# EAGLE design BaseBoard_1 (EAGLE 9.6.2)
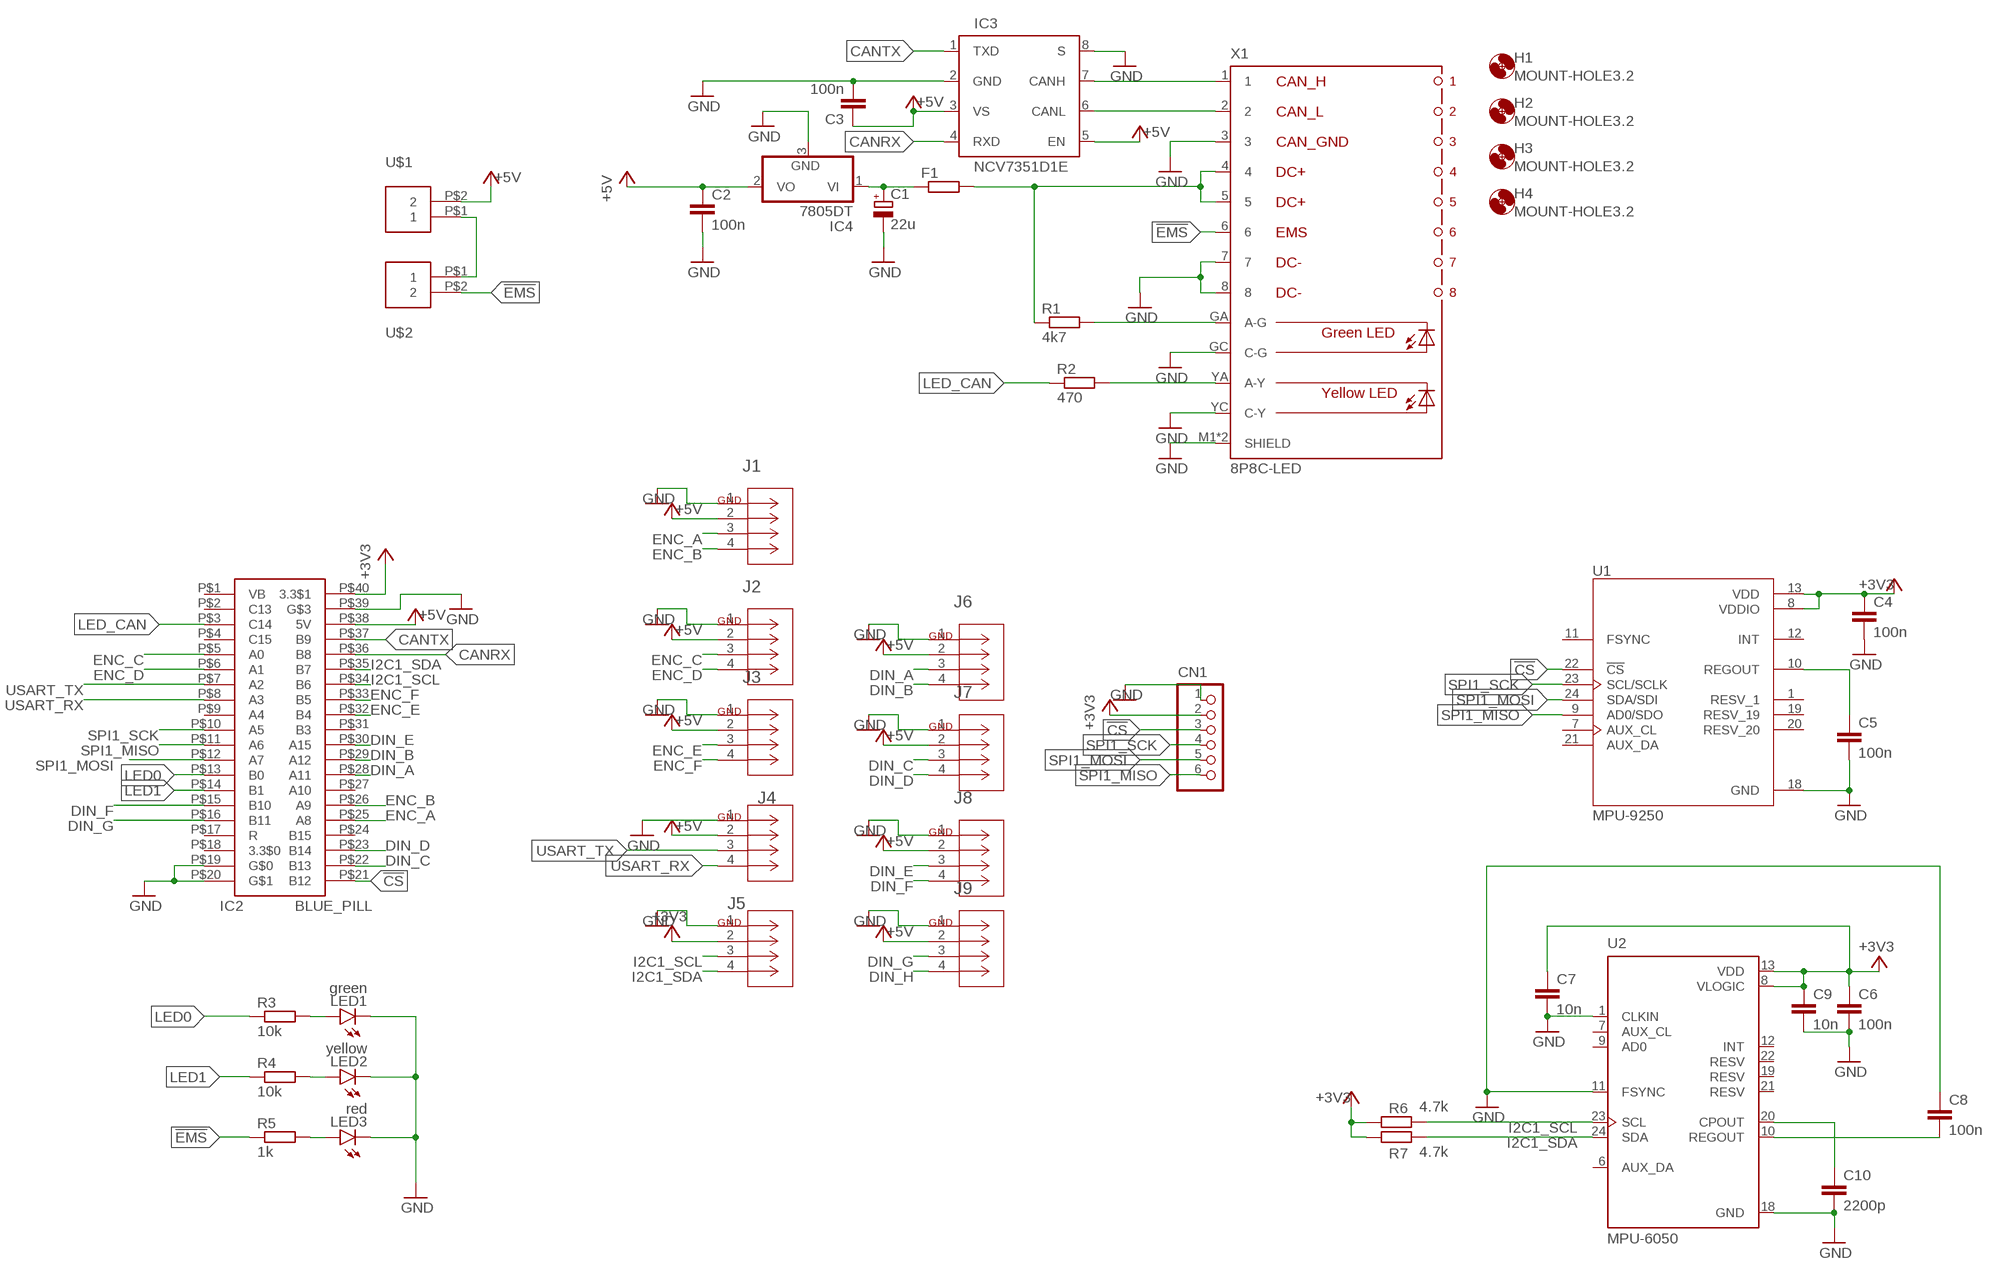
[diagram p0: schematic, sheet 1]

## Parts
C1  22u  CPOL-EUE2.5-5  [E2,5-5]
C2  100n  C-EUC0603  [C0603]
C3  100n  C-EUC0603  [C0603]
C4  100n  C-EUC0603  [C0603]
C5  100n  C-EUC0603  [C0603]
C6  100n  C-EUC0603  [C0603]
C7  10n  C-EUC0603  [C0603]
C8  100n  C-EUC0603  [C0603]
C9  10n  C-EUC0603  [C0603]
C10  2200p  C-EUC0603  [C0603]
CN1  S6B-XH-A  [S6B-XH-A]
F1  R-EU_R1206  [R1206]
H1  MOUNT-HOLE3.2  [3,2]
H2  MOUNT-HOLE3.2  [3,2]
H3  MOUNT-HOLE3.2  [3,2]
H4  MOUNT-HOLE3.2  [3,2]
IC2  BLUE_PILL  [BLUE_PILL]
IC3  NCV7351D1E  [SO08]
IC4  7805DT  [TO252]
J1  EP2.5-4-SIDE  [CONN4_1744426-4]
J2  EP2.5-4-SIDE  [CONN4_1744426-4]
J3  EP2.5-4-SIDE  [CONN4_1744426-4]
J4  EP2.5-4-SIDE  [CONN4_1744426-4]
J5  EP2.5-4-SIDE  [CONN4_1744426-4]
J6  EP2.5-4-SIDE  [CONN4_1744426-4]
J7  EP2.5-4-SIDE  [CONN4_1744426-4]
J8  EP2.5-4-SIDE  [CONN4_1744426-4]
J9  EP2.5-4-SIDE  [CONN4_1744426-4]
LED1  green  LEDCHIPLED_0805  [CHIPLED_0805]
LED2  yellow  LEDCHIPLED_0805  [CHIPLED_0805]
LED3  red  LEDCHIPLED_0805  [CHIPLED_0805]
R1  4k7  R-EU_R0603  [R0603]
R2  470  R-EU_R0603  [R0603]
R3  10k  R-EU_R0603  [R0603]
R4  10k  R-EU_R0603  [R0603]
R5  1k  R-EU_R0603  [R0603]
R6  4.7k  R-EU_R0603  [R0603]
R7  4.7k  R-EU_R0603  [R0603]
U1  MPU-9250  [QFN40P300X300X105-24N]
U2  MPU-6050  [QFN50P400X400X95-24N]
U$1  XH-2-STRAIGHT  [CON-XH-2-STRAIGHT]
U$2  XH-2-STRAIGHT  [CON-XH-2-STRAIGHT]
X1  8P8C-LED  [8P8C-LED]

## Nets
!CS: CN1.3 IC2.P$21(B12) U1.22(!CS)
!EMS: R5.1 U$2.P$2 X1.6
+3V3: C4.1 C6.1 C7.1 C9.1 CN1.2 IC2.P$40(3.3$1) J5.2 R6.1 R7.1 U1.8(VDDIO) U1.13(VDD) U2.8(VLOGIC) U2.13(VDD)
+5V: C2.1 C3.1 IC2.P$38(5V) IC3.3(VS) IC3.5(EN) IC4.2(VO) J1.2 J2.2 J3.2 J4.2 J6.2 J7.2 J8.2 J9.2 U$1.P$2
CANRX: IC2.P$36(B8) IC3.4(RXD)
CANTX: IC2.P$37(B9) IC3.1(TXD)
DIN_A: IC2.P$28(A11) J6.3
DIN_B: IC2.P$29(A12) J6.4
DIN_C: IC2.P$22(B13) J7.3
DIN_D: IC2.P$23(B14) J7.4
DIN_E: IC2.P$30(A15) J8.3
DIN_F: IC2.P$15(B10) J8.4
DIN_G: IC2.P$16(B11) J9.3
DIN_H: J9.4
ENC_A: IC2.P$25(A8) J1.3
ENC_B: IC2.P$26(A9) J1.4
ENC_C: IC2.P$5(A0) J2.3
ENC_D: IC2.P$6(A1) J2.4
ENC_E: IC2.P$32(B4) J3.3
ENC_F: IC2.P$33(B5) J3.4
GND: C1.- C2.2 C3.2 C4.2 C5.2 C6.2 C7.2 C8.1 C9.2 C10.2 CN1.1 IC2.P$19(G$0) IC2.P$20(G$1) IC2.P$39(G$3) IC3.2(GND) IC3.8(S) IC4.3(GND) J1.1 J2.1 J3.1 J4.1 J5.1 J6.1 J7.1 J8.1 J9.1 LED1.C LED2.C LED3.C U1.18(GND) U2.1(CLKIN) U2.11(FSYNC) U2.18(GND) X1.3 X1.7 X1.8 X1.GC(C-G) X1.M1(SHIELD) X1.M2(SHIELD) X1.YC(C-Y)
I2C1_SCL: IC2.P$34(B6) J5.3 R6.2 U2.23(SCL)
I2C1_SDA: IC2.P$35(B7) J5.4 R7.2 U2.24(SDA)
LED0: IC2.P$13(B0) R3.1
LED1: IC2.P$14(B1) R4.1
LED_CAN: IC2.P$3(C14) R2.1
N$1: R1.2 X1.GA(A-G)
N$2: F1.2 R1.1 X1.4 X1.5
N$3: C1.+ F1.1 IC4.1(VI)
N$4: IC3.7(CANH) X1.1
N$5: IC3.6(CANL) X1.2
N$7: C8.2 U2.10(REGOUT)
N$8: C10.1 U2.20(CPOUT)
N$9: R2.2 X1.YA(A-Y)
N$11: U$1.P$1 U$2.P$1
N$13: LED1.A R3.2
N$14: LED2.A R4.2
N$15: LED3.A R5.2
N$20: C5.1 U1.10(REGOUT)
SPI1_MISO: CN1.6 IC2.P$11(A6) U1.9(AD0/SDO)
SPI1_MOSI: CN1.5 IC2.P$12(A7) U1.24(SDA/SDI)
SPI1_SCK: CN1.4 IC2.P$10(A5) U1.23(SCL/SCLK)
USART_RX: IC2.P$8(A3) J4.4
USART_TX: IC2.P$7(A2) J4.3
Unconnected: IC2.P$1(VB) IC2.P$2(C13) IC2.P$4(C15) IC2.P$9(A4) IC2.P$17(R) IC2.P$18(3.3$0) IC2.P$24(B15) IC2.P$27(A10) IC2.P$31(B3) U1.1(RESV_1) U1.7(AUX_CL) U1.11(FSYNC) U1.12(INT) U1.19(RESV_19) U1.20(RESV_20) U1.21(AUX_DA) U2.6(AUX_DA) U2.7(AUX_CL) U2.9(AD0) U2.12(INT) U2.19(RESV) U2.21(RESV) U2.22(RESV)

## Library data of the parts
C1 = rcl:CPOL-EU: POLARIZED CAPACITOR, European symbol; SPICEPREFIX: C
C2-C10 = rcl:C-EU: CAPACITOR, European symbol; SPICEPREFIX: C
CN1 = jst-xh:S6B-XH-A: Wire-to-Board 2.5mm pitch side mount connector Source: http://www.jst-mfg.com/product/pdf/jpn/XH.pdf http://www.jst-mfg.com/product/detail.php?series=277
F1 R1-R7 = rcl:R-EU_: RESISTOR, European symbol; SPICEPREFIX: R
H1-H4 = holes:MOUNT-HOLE: MOUNTING HOLE with drill center marker
IC2 = stm32_mcu:BLUE_PILL
IC3 = on-semi:NCV7351D1E: High Speed CAN Transceiver Source: NCV7351-D.PDF <http://www.onsemi.com/PowerSolutions/document/NCV7351-D.PDF>
IC4 = linear:78*: Positive VOLTAGE REGULATOR Source: http://cache.national.com/ds/LM/LM78L05.pdf http://www.fairchildsemi.com/ds/LM/LM7805.pdf
J1-J9 = con-ep2.5:EP2.5-4-SIDE; MANUFACTURER_PART_NUMBER: 17444264; VENDOR: TE Connectivity
LED1-LED3 = led:LED: LED OSRAM: - CHIPLED LG R971, LG N971, LY N971, LG Q971, LY Q971, LO R971, LY R971 LH N974, LH R974 LS Q976, LO Q976, LY Q976 LO Q996 - Hyper CHIPLED LW Q18S LB Q993, LB Q99A, LB R99A - SideLED LS A670, LO A670, LY A670, LG A670, LP A670 LB A673, LV A673, LT A673, LW A673 LH A674 LY A675 LS A676, LA A676, LO A676, LY A676, LW A676 LS A679, LY A679, LG A679 - Hyper Micro SIDELED® LS Y876, LA Y876, LO Y876, LY Y876 LT Y87S - SmartLED LW L88C, LW L88S LB L89C, LB L89S, LG L890 LS L89K, LO L89K, LY L89K LS L896, LA L896, LO L896, LY L896 - TOPLED LS T670, LO T670, LY T670, LG T670, LP T670 LSG T670, LSP T670, LSY T670, LOP T670, LYG T670 LG T671, LOG T671, LSG T671 LB T673, LV T673, LT T673, LW T673 LH T674 LS T676, LA T676, LO T676, LY T676, LB T676, LH T676, LSB T676, LW T676 LB T67C, LV T67C, LT T67C, LS T67K, LO T67K, LY T67K, LW E67C LS E67B, LA E67B, LO E67B, LY E67B, LB E67C, LV E67C, LT E67C LW T67C LS T679, LY T679, LG T679 LS T770, LO T770, LY T770, LG T770, LP T770 LB T773, LV T773, LT T773, LW T773 LH T774 LS E675, LA E675, LY E675, LS T675 LS T776, LA T776, LO T776, LY T776, LB T776 LHGB T686 LT T68C, LB T68C - Hyper Mini TOPLED® LB M676 - Mini TOPLED Santana® LG M470 LS M47K, LO M47K, LY M47K Source: http://www.osram.convergy.de LUXEON: - LUMILED® LXK2-PW12-R00, LXK2-PW12-S00, LXK2-PW14-U00, LXK2-PW14-V00 LXK2-PM12-R00, LXK2-PM12-S00, LXK2-PM14-U00 LXK2-PE12-Q00, LXK2-PE12-R00, LXK2-PE12-S00, LXK2-PE14-T00, LXK2-PE14-U00 LXK2-PB12-K00, LXK2-PB12-L00, LXK2-PB12-M00, LXK2-PB14-N00, LXK2-PB14-P00, LXK2-PB14-Q00 LXK2-PR12-L00, LXK2-PR12-M00, LXK2-PR14-Q00, LXK2-PR14-R00 LXK2-PD12-Q00, LXK2-PD12-R00, LXK2-PD12-S00 LXK2-PH12-R00, LXK2-PH12-S00 LXK2-PL12-P00, LXK2-PL12-Q00, LXK2-PL12-R00 Source: www.luxeon.com KINGBRIGHT: KA-3528ASYC Source: www.kingbright.com
U1 = MPU-9250:MPU-9250: Axis=3 Axis Gyro+3 Axis Accel+Compass. Pin For Pin With m; AVAILABILITY: Unavailable; DESCRIPTION: SMD Gyroscope/Accelerometer/Magnetometer Sensor; 9-AXIS; MF: TDK InvenSense; MP: MPU-9250; PACKAGE: QFN-24 TDK InvenSense; PRICE: None
U2 = MPU-6050:MPU-6050: MPU-6050 Six-Axis (Gyro + Accelerometer) MEMS MotionTracking™ Devices Check availability <https://pricing.snapeda.com/parts/MPU-6050/TDK%20InvenSense/view-part?ref=eda>; AVAILABILITY: In Stock; DESCRIPTION: MPU-6050 series Accelerometer, Gyroscope, 3 Axis Sensor Evaluation Board; MF: TDK InvenSense; MP: MPU-6050; PACKAGE: VFQFN-24 TDK InvenSense; PRICE: None; PURCHASE-URL: https://pricing.snapeda.com/search/part/MPU-6050/?ref=eda
U$1 U$2 = con-xh:XH-2-STRAIGHT
X1 = con-rj45:8P8C-LED: generic 8P8C connector with two LED's; OC_FARNELL: unknown; OC_NEWARK: unknown

## Board
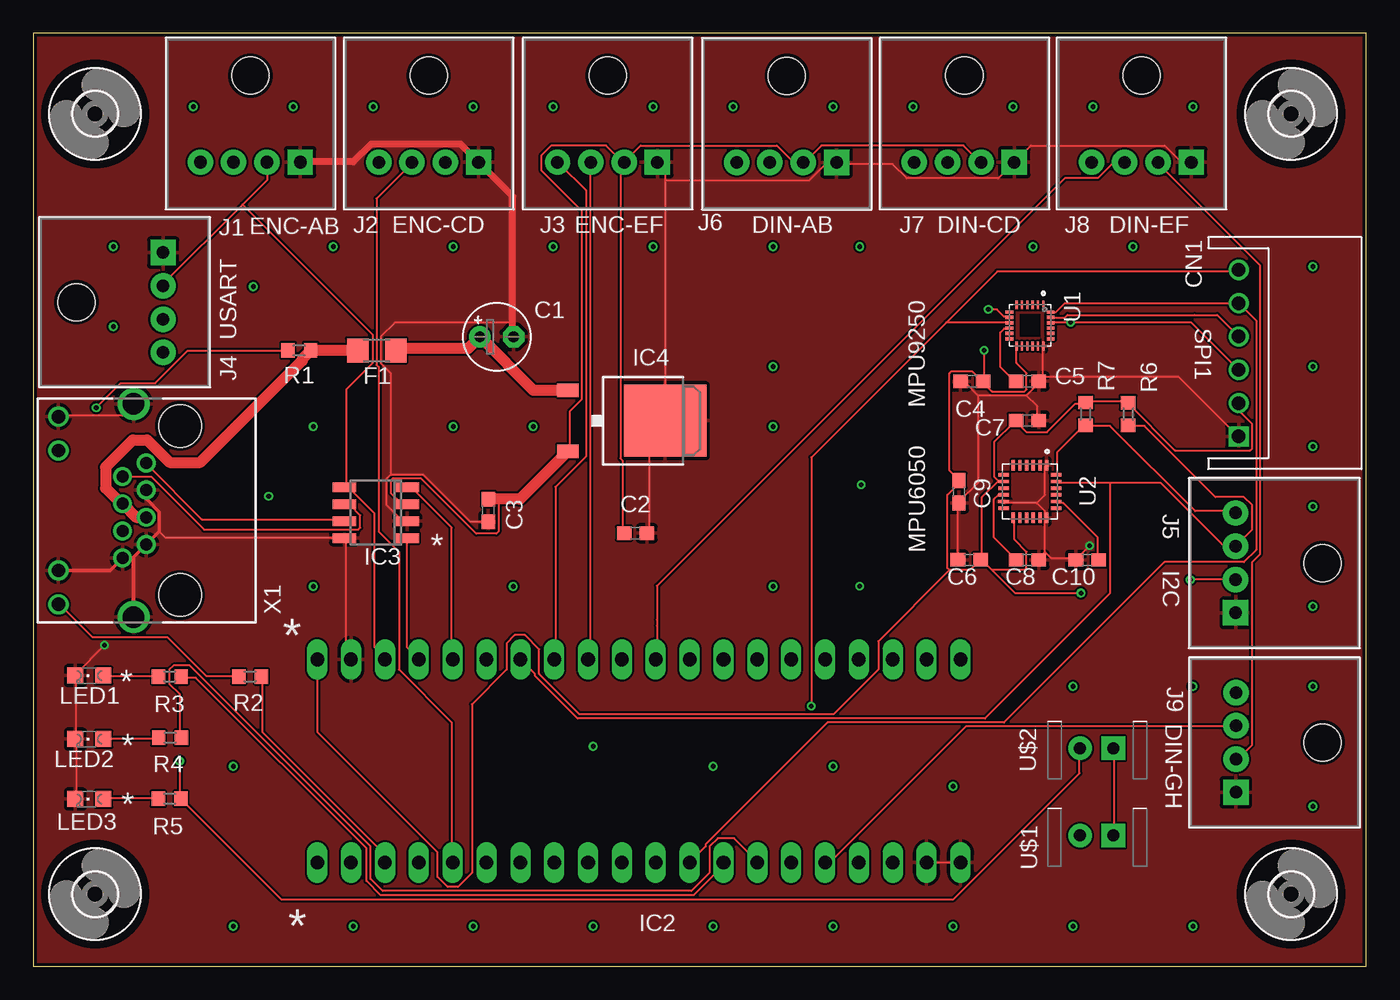
[diagram p1: board, top side]
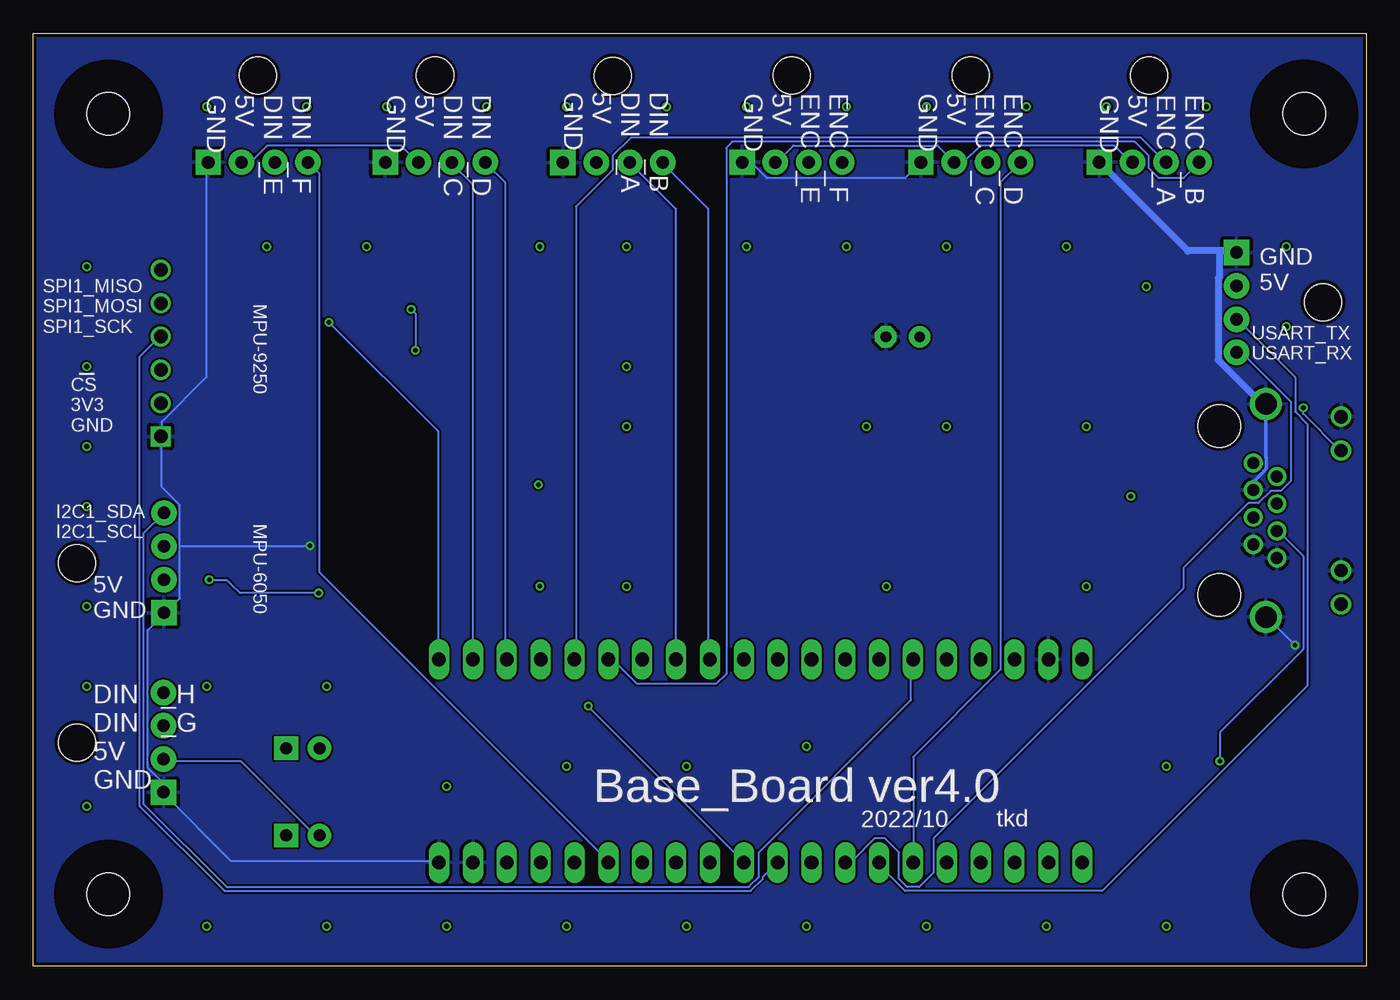
[diagram p2: board, bottom side, seen from below]

Size 100 x 70 mm. Coordinates in mm from the lower left corner, seen from the top.
Outline: 0,0 100,0 100,70 0,70 0,0
Copper layers (1*16): Top 0.035mm / dielectric 1.5mm / Bottom 0.035mm
Design rules "SeeedStudio_2layer_DRU_no_angle_20140221": minimum track width 6mil, minimum drill 12mil, track to track 6mil, track to pad 6mil, pad to pad 6mil, via to via 6mil, smd to smd 0mil, copper to edge 10mil, drill to drill 10mil, minimum pad ring 10mil, minimum via ring 6mil, stop-mask expansion 2mil, vias tented up to drill 100mil, thermal gap 10mil

### Footprints (pad centres in the part's own frame; a part is rotated, then mirrored left to right if it is on the bottom)
E2,5-5 = drill 0.813 pad 1.6: + -1.27,0 | drill 0.813 pad 1.6 octagon: - 1.27,0
C0603 = smd 1.1 x 1: 1 -0.85,0; 2 0.85,0
S6B-XH-A = drill 1.016 square: 1 6.25,0 | drill 1.016: 2 3.75,0; 3 1.25,0; 4 -1.25,0; 5 -3.75,0; 6 -6.25,0
R1206 = smd 1.6 x 1.803: 1 -1.422,0; 2 1.422,0
3,2 = hole 3.2: 0,0
BLUE_PILL = drill 1.016 long: P$1 -7.62,10.16; P$2 -7.62,7.62; P$3 -7.62,5.08; P$4 -7.62,2.54; P$5 -7.62,0; P$6 -7.62,-2.54; P$7 -7.62,-5.08; P$8 -7.62,-7.62; P$9 -7.62,-10.16; P$10 -7.62,-12.7; P$11 -7.62,-15.24; P$12 -7.62,-17.78; P$13 -7.62,-20.32; P$14 -7.62,-22.86; P$15 -7.62,-25.4; P$16 -7.62,-27.94; P$17 -7.62,-30.48; P$18 -7.62,-33.02; P$19 -7.62,-35.56; P$20 -7.62,-38.1; P$21 7.62,-38.1; P$22 7.62,-35.56; P$23 7.62,-33.02; P$24 7.62,-30.48; P$25 7.62,-27.94; P$26 7.62,-25.4; P$27 7.62,-22.86; P$28 7.62,-20.32; P$29 7.62,-17.78; P$30 7.62,-15.24; P$31 7.62,-12.7; P$32 7.62,-10.16; P$33 7.62,-7.62; P$34 7.62,-5.08; P$35 7.62,-2.54; P$36 7.62,0; P$37 7.62,2.54; P$38 7.62,5.08; P$39 7.62,7.62; P$40 7.62,10.16
SO08 = smd 0.72 x 1.78: 1 -1.905,-2.35; 2 -0.635,-2.35; 3 0.635,-2.35; 4 1.905,-2.35; 5 1.905,2.35; 6 0.635,2.35; 7 -0.635,2.35; 8 -1.905,2.35
TO252 = smd 1 x 1.6: 1 -2.28,-4.8; 2 2.28,-4.8 | smd 5.4 x 6.2: 3 0,2.5
CONN4_1744426-4 = drill 0.94 pad 1.905 square: 1 7.493,0 | drill 0.94 pad 1.905: 2 5.004,0; 3 2.489,0; 4 0,0 | hole 2.794: 3.759,6.502
CHIPLED_0805 = smd 1.2 x 1.2: A 0,-1.05; C 0,1.05
R0603 = smd 1 x 1.1: 1 -0.85,0; 2 0.85,0
QFN40P300X300X105-24N = smd 0.64 x 0.22: 1 -1.545,1; 2 -1.545,0.6; 3 -1.545,0.2; 4 -1.545,-0.2; 5 -1.545,-0.6; 6 -1.545,-1; 13 1.545,-1; 14 1.545,-0.6; 15 1.545,-0.2; 16 1.545,0.2; 17 1.545,0.6; 18 1.545,1 | smd 0.22 x 0.64: 7 -1,-1.545; 8 -0.6,-1.545; 9 -0.2,-1.545; 10 0.2,-1.545; 11 0.6,-1.545; 12 1,-1.545; 19 1,1.545; 20 0.6,1.545; 21 0.2,1.545; 22 -0.2,1.545; 23 -0.6,1.545; 24 -1,1.545
QFN50P400X400X95-24N = smd 0.79 x 0.26: 1 -1.97,1.25; 2 -1.97,0.75; 3 -1.97,0.25; 4 -1.97,-0.25; 5 -1.97,-0.75; 6 -1.97,-1.25; 13 1.97,-1.25; 14 1.97,-0.75; 15 1.97,-0.25; 16 1.97,0.25; 17 1.97,0.75; 18 1.97,1.25 | smd 0.26 x 0.79: 7 -1.25,-1.97; 8 -0.75,-1.97; 9 -0.25,-1.97; 10 0.25,-1.97; 11 0.75,-1.97; 12 1.25,-1.97; 19 1.25,1.97; 20 0.75,1.97; 21 0.25,1.97; 22 -0.25,1.97; 23 -0.75,1.97; 24 -1.25,1.97
CON-XH-2-STRAIGHT = drill 0.9 pad 1.778 square: P$1 1.21,-0.73 | drill 0.9 pad 1.778: P$2 -1.29,-0.73
8P8C-LED = drill 0.9 pad 1.3: 1 3.57,-3.81; 2 2.55,-2.03; 3 1.53,-3.81; 4 0.51,-2.03; 5 -0.51,-3.81; 6 -1.53,-2.03; 7 -2.55,-3.81; 8 -3.57,-2.03 | drill 1 pad 1.422: GA 4.5,2.78; GC 7.04,2.78; YA -7.04,2.78; YC -4.5,2.78 | drill 1.6 pad 2.184: M1 -8,-2.85; M2 8,-2.85 | hole 3.2: 6.35,-6.35; -6.35,-6.35

### Placement (x,y rotation side)
C1  34.77,47.23 0 top
C2  45.18,32.49 0 top
C3  34.13,34.2 270 top
C4  70.42,43.88 180 top
C5  74.58,43.89 0 top
C6  70.22,30.49 180 top
C7  74.58,40.94 0 top
C8  74.58,30.49 180 top
C9  69.44,35.6 270 top
C10  79.07,30.48 180 top
CN1  90.44,46 270 top
F1  25.77,46.2 180 top
H1  94.37,63.96 0 top
H2  4.64,63.96 0 top
H3  94.37,5.4 0 top
H4  4.64,5.41 0 top
IC2  31.46,15.4 90 top
IC3  25.69,34.03 90 top
IC4  44.9,40.93 270 top
J1  12.53,60.33 0 top
J2  25.91,60.33 0 top
J3  39.33,60.33 0 top
J4  9.74,46.06 90 top
J5  90.21,34.01 270 top
J6  52.77,60.31 0 top
J7  66.1,60.33 0 top
J8  79.39,60.33 0 top
J9  90.23,20.54 270 top
LED1  4.21,21.8 90 top
LED2  4.21,17.05 90 top
LED3  4.21,12.54 90 top
R1  19.96,46.21 180 top
R2  16.27,21.74 180 top
R3  10.24,21.74 180 top
R4  10.26,17.14 180 top
R5  10.23,12.56 180 top
R6  82.14,41.43 270 top
R7  78.94,41.44 270 top
U1  74.78,48.08 270 top
U2  74.77,35.62 270 top
U$1  79.82,10.54 0 top
U$2  79.83,17.08 0 top
X1  4.66,34.19 90 top

### Tracks (layer width: path | path; a pad name or v marks a point on that pad's centre or on a via)
!CS  (via drill 0.35)
  Top 0.152: U1.22 76.35,48.31 v77.82,48.31 86.87,48.31 90.37,44.81 CN1.3
  Bottom 0.152: v77.82,48.31 69.65,40.14 69.65,23.16 IC2.P$21
!EMS  (via drill 0.35)
  Top 0.152: v10.97,15.39 10.97,12.65 R5.1 11.12,12.5 18.59,5.03 69.04,5.03 78.49,14.48 78.49,16.31 U$2.P$2
  Bottom 0.152: v10.97,15.39 10.97,17.53 4.72,23.77 4.72,30.79 6.55,32.61 X1.6
+3V3  (via drill 0.35)
  Top 0.152: 72.39,36.42 72.69,36.42 U2.8 | 72.39,36.42 72.08,36.73 72.08,39.32 73.61,40.84 C7.1 73.76,40.84 74.52,40.08 76.05,40.08 78.18,42.22 78.79,42.22 R7.1 78.94,42.37 81.99,42.37 R6.1 82.14,42.22 85.65,38.71 91.29,38.71 91.44,38.86 91.44,40.69 90.53,41.6 90.53,42.22 CN1.2 | 71.32,43.74 71.93,43.13 74.37,43.13 74.52,43.28 74.52,44.5 73.76,45.26 73.76,46.48 U1.13 | 71.32,43.74 C4.1 71.17,43.89 70.41,44.65 68.89,44.65 68.73,44.5 68.73,37.19 69.34,36.58 C9.1 69.34,36.42 69.34,36.12 68.58,35.36 68.58,29.87 68.73,29.72 | 71.93,29.72 74.37,29.72 74.52,29.87 74.52,31.09 73.61,32 73.61,33.53 U2.13 | 71.93,29.72 71.17,30.48 C6.1 | 68.73,29.72 70.26,29.72 71.02,30.48 C6.1 | 68.73,29.72 63.4,24.38 63.4,22.25 60.05,18.9 41,18.9 37.95,21.95 37.95,23.77 36.88,24.84 36.12,24.84 35.51,24.23 35.51,22.25 32.92,19.66 32.92,7.01 31.85,5.94 31.09,5.94 30.33,6.71 30.33,8.53 21.34,17.53 21.34,23.01 IC2.P$40 | 72.39,36.42 71.17,35.2 71.17,30.63 C6.1 | U1.8 73.17,48.74 72.83,48.74 72.3,49.28 71.68,49.28 v71.66,49.3 | v71.34,46.22 71.34,43.75 71.32,43.74 | 71.93,29.72 73.65,28 v78.6,28 | J5.2 v86.81,29.01 v86.8,29
  Bottom 0.152: v71.66,49.3 71.34,48.97 v71.34,46.22 | v78.6,28 84.5,28 85.15,28.65 85.3,28.8 85.5,29 v86.8,29
+5V
  Top 0.152: IC2.P$38 26.36,23.16 25.6,23.93 25.6,33.98 23.77,35.81 23.47,35.81 IC3.5 23.47,35.97 23.47,43.28 25.45,45.26 25.45,47.4 15.7,57.15 | 15.7,57.15 17.53,58.98 17.53,60.2 J1.2 | 15.7,57.15 9.75,51.21 J4.2 | J9.2 90.37,15.54 91.44,16.61 91.44,30.33 92.05,30.94 92.05,52.58 84.43,60.2 J8.2 | J7.2 71.02,60.35 69.8,61.57 59.13,61.57 57.91,60.35 J6.2 57.76,60.35 57,60.35 55.78,61.57 45.57,61.57 44.35,60.35 J3.2 | 34.9,35.05 36.58,35.05 40.08,38.56 IC4.2 40.23,38.71 40.23,41.6 41.15,42.52 41.15,56.69 38.1,59.74 38.1,60.81 38.86,61.57 42.98,61.57 44.2,60.35 J3.2 | 34.9,35.05 34.3,35.05 C3.1 | 34.9,35.05 34.9,32.61 34.75,32.46 33.22,32.46 29.11,36.58 26.98,36.58 26.82,36.42 26.82,35.51 27.58,34.75 27.89,34.75 IC3.3 | C2.1 44.2,32.61 44.2,37.95 44.04,38.1 44.04,60.05 44.2,60.2 J3.2
  Top 0.813: IC4.2 36.5,35.05 34.3,35.05
  Bottom 0.152: J1.2 17.68,60.35 18.9,61.57 28.96,61.57 30.18,60.35 30.79,60.35 J2.2 30.94,60.35 32.16,61.57 42.98,61.57 44.2,60.35 J3.2 | U$1.P$2 78.64,9.91 78.94,9.91 84.43,15.39 90.22,15.39 J9.2 | J8.2 84.28,60.35 83.67,60.35 82.45,61.57 72.39,61.57 71.17,60.35 J7.2
CANRX
  Top 0.152: IC3.4 28.04,35.81 28.5,35.81 31.39,32.92 31.39,23.16 IC2.P$36
CANTX
  Top 0.152: IC3.1 28.04,32 28.04,23.93 28.8,23.16 IC2.P$37
DIN_A
  Bottom 0.152: IC2.P$28 51.82,23.16 51.82,56.84 55.17,60.2 J6.3
DIN_B
  Bottom 0.152: IC2.P$29 49.38,23.16 49.38,56.84 52.73,60.2 J6.4
DIN_C
  Bottom 0.152: IC2.P$22 67.06,23.16 67.06,58.67 68.58,60.2 J7.3
DIN_D
  Bottom 0.152: IC2.P$23 64.62,23.16 64.62,58.83 65.99,60.2 J7.4
DIN_E
  Top 0.152: IC2.P$30 46.79,23.16 46.79,25.55 46.79,26.01 46.79,28.53 77.4,59.15 79.88,59.15 81.06,60.33 J8.3
DIN_F
  Bottom 0.152: IC2.P$15 57,7.92 57,8.03 78.54,29.57 78.54,59.49 79.25,60.2 J8.4
DIN_G
  Top 0.152: IC2.P$16 59.44,7.92 59.89,7.92 69.95,17.98 90.22,17.98 J9.3
ENC_A
  Bottom 0.152: IC2.P$25 59.28,23.16 59.28,57 56.54,59.74 56.54,60.81 55.17,62.18 16.92,62.18 15.09,60.35 J1.3
ENC_B
  Bottom 0.152: IC2.P$26 56.84,23.01 56.54,23.01 54.71,21.18 48.77,21.18 48.01,21.95 48.01,61.42 47.55,61.87 17.37,61.87 16.31,60.81 16.31,59.89 15.54,59.13 13.72,59.13 12.65,60.2 J1.4
ENC_C
  Top 0.152: IC2.P$5 31.39,7.92 31.39,18.29 27.43,22.25 27.43,31.09 25.91,32.61 25.91,44.96 25.76,45.11 25.76,57.61 28.35,60.2 J2.3
ENC_D
  Bottom 0.152: IC2.P$6 33.98,7.92 33.98,15.7 27.43,22.25 27.43,58.83 26.06,60.2 J2.4
ENC_E
  Top 0.152: IC2.P$32 41.76,23.16 41.76,60.2 J3.3
ENC_F
  Top 0.152: IC2.P$33 39.17,23.16 39.17,35.97 41.45,38.25 41.45,58.22 39.47,60.2 J3.4
GND  (via drill 0.35)
  Top 0.152: LED3.C 3.2,12.65 3.2,16.96 LED2.C 3.2,17.11 3.2,21.79 LED1.C 3.2,21.95 v5.33,24.08 | X1.GC 1.98,41.3 6.71,41.3 7.47,42.06 X1.M2 | IC2.P$39 23.77,23.16 23.47,23.47 23.47,32 IC3.8 23.32,32.16 9.91,32.16 9.45,32.61 | 7.47,30.63 7.4,30.63 6.71,30.63 | 7.47,30.63 8.38,31.55 X1.7 | 5.79,29.72 1.98,29.72 X1.YC | 7.47,30.63 7.47,26.21 X1.M1 | C6.2 69.34,30.63 69.34,34.75 C9.2 69.49,34.9 70.87,36.27 70.87,42.82 | 75.74,44.2 75.74,46.48 U1.18 | 75.74,44.2 C5.2 | 70.87,42.82 69.95,43.74 69.65,43.74 C4.2 | 74.52,42.82 70.87,42.82 | 74.52,42.82 75.44,43.74 C5.2 | 74.52,42.82 75.29,42.06 75.29,41 C7.2 | 75.89,31.09 75.89,33.53 U2.18 75.89,33.68 75.89,34.14 75.29,34.75 | 75.89,31.09 75.44,30.63 C8.1 | 75.29,34.75 72.85,34.75 U2.11 | 75.29,34.75 75.89,35.36 75.89,37.49 U2.1 | 75.89,31.09 76.35,30.63 78.18,30.63 C10.2 78.33,30.63 v79.25,31.55 | IC2.P$19 67.06,7.77 69.49,7.77 IC2.P$20 | 75.74,44.2 85.95,44.2 90.37,39.78 CN1.1 | 75.74,44.2 C5.2 | J8.1 86.87,60.35 86.11,60.35 84.89,61.57 74.83,61.57 73.61,60.35 J7.1 73.46,60.2 72.39,59.13 65.53,59.13 64.47,60.2 60.35,60.2 J6.1 60.2,60.2 59.44,60.2 58.22,58.98 47.4,58.98 | C2.2 46.18,32.61 46.18,39.62 47.4,40.84 IC4.3 47.4,41 47.4,58.98 | 26.82,36.88 29.26,36.88 32.77,33.38 33.98,33.38 C3.2 | 26.82,36.88 26.52,36.58 26.52,34.59 27.58,33.53 27.89,33.53 IC3.2 | 35.97,57.76 35.97,48.31 | 35.97,48.31 35.97,47.24 C1.- | 26.82,36.88 26.82,44.5 26.06,45.26 26.06,47.24 27.13,48.31 35.97,48.31 | 47.4,58.98 47.4,59.74 46.94,60.2 J3.1 | 20.12,60.35 J1.1 | 9.46,33.3 9.46,33.27
  Top 0.254: X1.3 8.53,35.66 8.53,35.01 9.46,34.09 9.46,33.3 | 7.4,30.63 7.46,30.63 X1.7 9.45,32.61 9.46,32.62 9.46,33.27 | 7.47,30.63 7.51,30.59 X1.M1 | 6.71,30.63 6.7,30.63 X1.8 5.79,29.72 5.76,29.69 X1.YC
  Top 0.508: C1.- 35.97,47.3 35.97,57.76 35.97,57.77 J2.1 32.05,61.69 25.35,61.69 24.01,60.35 20.12,60.35
  Bottom 0.152: 13.41,53.65 10.97,53.65 | 10.97,53.65 9.75,53.65 9.75,53.63 J4.1 | v5.33,24.08 7.47,26.21 X1.M1 | 8.09,36.71 8.18,36.63 | 10.97,53.65 10.97,45.57 7.62,42.22 X1.M2 | 89,31.55 89,27.58 90.07,26.52 J5.1 90.22,26.36 91.44,25.15 91.44,14.94 90.37,13.87 90.37,13.11 J9.1 90.22,12.95 85.19,7.92 69.65,7.92 IC2.P$20 | 89,31.55 89,34.59 90.37,35.97 90.37,39.62 CN1.1 90.37,39.78 90.37,40.84 87.02,44.2 87.02,60.2 J8.1 | 89,31.55 v79.25,31.55 | J3.1 46.79,60.2 46.02,60.2 44.96,59.13 34.59,59.13 33.53,60.2 J2.1
  Bottom 0.254: X1.M2 7.51,38.19 7.49,38.17 7.49,37.34 7.68,37.15 7.68,37.13 8.09,36.71 | 8.18,36.63 8.47,36.33 X1.3
  Bottom 0.508: J1.1 13.41,53.72 | 13.41,53.65 13.41,53.72 | 13.41,53.72 11.01,53.72 | 11.01,53.72 9.84,53.72 9.75,53.63 | 11.01,53.72 11.01,51.71 11.1,51.63 11.1,45.5 7.82,42.22 7.62,42.22
  pour Bottom: 0.1,70 0.1,0 100.1,0 100.2,-0.1 100.2,70 100.1,70.1 0.2,70.1
  pour Top: 0,70 0,0.1 0.2,-0.1 99.7,-0.1 100.1,0.3 100.1,70 100,70.1 0.1,70.1
I2C1_SCL
  Top 0.152: 80.77,36.27 84.58,36.27 89.31,31.55 90.07,31.55 J5.3 90.22,31.55 91.44,32.77 91.44,34.59 90.83,35.2 88.7,35.2 83.36,40.54 82.14,40.54 R6.2 | 80.77,36.27 76.81,36.27 U2.23 | 80.77,36.27 80.77,27.97 71.39,18.59 40.84,18.59 37.64,21.79 37.64,21.95 36.58,23.01 IC2.P$34
I2C1_SDA
  Top 0.152: U2.24 76.81,36.88 76.81,38.56 78.79,40.54 R7.2 78.94,40.54 80.77,40.54 87.17,34.14 90.07,34.14 J5.4
  Bottom 0.152: IC2.P$35 34.14,23.01 34.14,19.96 45.57,8.53 45.57,6.71 46.33,5.94 85.5,5.94 91.75,12.19 91.75,32.46 90.22,33.98 J5.4
LED0
  Top 0.152: R3.1 11.12,21.64 12.19,21.64 24.99,8.84 24.99,6.4 26.06,5.33 49.53,5.33 51.66,7.47 51.66,7.77 IC2.P$13
LED1
  Top 0.152: R4.1 10.97,17.21 10.97,20.42 10.21,21.18 10.21,22.25 10.52,22.55 11.73,22.55 25.3,8.99 25.3,6.55 26.21,5.64 49.38,5.64 50.75,7.01 50.75,8.99 51.36,9.6 52.58,9.6 54.25,7.92 IC2.P$14
LED_CAN
  Top 0.152: R2.1 17.22,21.64 17.22,17.53 26.36,8.38 26.36,7.92 IC2.P$3
N$1  (via drill 0.35)
  Top 0.152: v4.72,41.91 6.55,43.74 9.14,43.74 11.58,46.18 19.05,46.18 R1.2
  Bottom 0.152: v4.72,41.91 4.72,41.45 1.98,38.71 X1.GA
N$2
  Top 0.152: F1.2 24.23,46.33 20.88,46.33 R1.1 20.73,46.18 | 6.44,34.86 6.55,34.75 X1.4
  Top 0.813: F1.2 20.75,46.2 20.73,46.18 | R1.1 20.17,45.57 20.17,45.43 12.54,37.8 10.23,37.8 8.54,39.48 7.46,39.48 5.43,37.45 5.43,35.87 6.44,34.86 | X1.4 7.71,33.68 X1.5
N$3
  Top 0.152: 27.28,46.33 F1.1
  Top 0.813: IC4.1 37.52,43.21 C1.+ 33.5,47.22 32.61,46.33 27.28,46.33
N$4
  Top 0.152: IC3.7 23.32,33.53 12.65,33.53 8.53,37.64 X1.1
N$5
  Top 0.152: IC3.6 23.47,34.59 23.77,34.59 24.54,33.83 24.54,32.92 24.38,32.77 12.8,32.77 8.84,36.73 6.71,36.73 X1.2
N$6  (via drill 0.35)
  other vias: 15,3
N$7
  Top 0.152: U2.10 72.69,35.36 72.39,35.36 72.08,35.05 72.08,32.16 73.61,30.63 C8.2
N$8
  Top 0.152: U2.20 76.81,34.75 77.27,34.75 79.86,32.16 79.86,30.63 C10.1
N$9
  Top 0.152: R2.2 15.39,21.79 12.95,21.79 10.06,24.69 4.42,24.69 1.98,27.13 X1.YA
N$10  (via drill 0.35)
  other vias: 24,3
N$11
  Top 0.152: U$1.P$1 81.08,9.91 81.08,16.31 U$2.P$1
N$12  (via drill 0.35)
  other vias: 33,3
N$13
  Top 0.152: R3.2 9.3,21.79 5.33,21.79 LED1.A
N$14
  Top 0.152: LED2.A 9.27,17.05 R4.2
N$15
  Top 0.152: R5.2 9.3,12.65 5.33,12.65 LED3.A
N$16  (via drill 0.35)
  other vias: 42,3
N$17  (via drill 0.35)
  other vias: 51,3
N$18  (via drill 0.35)
  other vias: 60,3
N$19  (via drill 0.35)
  other vias: 69,3
N$20
  Top 0.152: U1.10 73.15,47.85 72.85,47.85 72.54,47.55 72.54,44.96 73.61,43.89 C5.1
N$21  (via drill 0.35)
  other vias: 78,3
N$22  (via drill 0.35)
  other vias: 87,3
N$23  (via drill 0.35)
  other vias: 87,21
N$24  (via drill 0.35)
  other vias: 78,21
N$25  (via drill 0.35)
  other vias: 69,13.5
N$26  (via drill 0.35)
  other vias: 60,15
N$27  (via drill 0.35)
  other vias: 51,15
N$28  (via drill 0.35)
  other vias: 42,16.5
N$29  (via drill 0.35)
  other vias: 15,15
N$30  (via drill 0.35)
  other vias: 62.12,36.12
N$31  (via drill 0.35)
  other vias: 75,54
N$32  (via drill 0.35)
  other vias: 82.5,54
N$33  (via drill 0.35)
  other vias: 55.5,54
N$34  (via drill 0.35)
  other vias: 96,39
N$35  (via drill 0.35)
  other vias: 46.5,54
N$36  (via drill 0.35)
  other vias: 39,54
N$37  (via drill 0.35)
  other vias: 31.5,54
N$38  (via drill 0.35)
  other vias: 22.5,54
N$39  (via drill 0.35)
  other vias: 16.5,51
N$40  (via drill 0.35)
  other vias: 55.5,45
N$41  (via drill 0.35)
  other vias: 55.5,40.5
N$42  (via drill 0.35)
  other vias: 31.5,40.5
N$43  (via drill 0.35)
  other vias: 37.5,40.5
N$44  (via drill 0.35)
  other vias: 21,40.5
N$45  (via drill 0.35)
  other vias: 21,28.5
N$46  (via drill 0.35)
  other vias: 36,28.5
N$47  (via drill 0.35)
  other vias: 55.5,28.5
N$48  (via drill 0.35)
  other vias: 96,45
N$49  (via drill 0.35)
  other vias: 96,52.5
N$50  (via drill 0.35)
  other vias: 96,27
N$51  (via drill 0.35)
  other vias: 62,54
N$52  (via drill 0.35)
  other vias: 62.01,28.52
N$53  (via drill 0.35)
  other vias: 96,34.5
N$54  (via drill 0.35)
  other vias: 96,21
N$55  (via drill 0.35)
  other vias: 96,12
N$56  (via drill 0.35)
  other vias: 87,64.5
N$57  (via drill 0.35)
  other vias: 79.5,64.5
N$58  (via drill 0.35)
  other vias: 73.5,64.5
N$59  (via drill 0.35)
  other vias: 66,64.5
N$60  (via drill 0.35)
  other vias: 60,64.5
N$61  (via drill 0.35)
  other vias: 17.66,35.26
N$62  (via drill 0.35)
  other vias: 46.5,64.5
N$63  (via drill 0.35)
  other vias: 39,64.5
N$64  (via drill 0.35)
  other vias: 52.5,64.5
N$65  (via drill 0.35)
  other vias: 33,64.5
N$66  (via drill 0.35)
  other vias: 25.5,64.5
N$67  (via drill 0.35)
  other vias: 19.5,64.5
N$68  (via drill 0.35)
  other vias: 12,64.5
N$69  (via drill 0.35)
  other vias: 6,54
N$70  (via drill 0.35)
  other vias: 6,48
SPI1_MISO  (via drill 0.35)
  Top 0.152: 68.51,48.31 73.15,48.31 U1.9 | 68.51,48.31 68.5,48.31 58.37,38.18 v58.37,19.51 | 68.51,48.31 72.32,52.12 90.37,52.12 CN1.6
  Bottom 0.152: v58.37,19.51 46.79,7.92 IC2.P$11
SPI1_MOSI
  Top 0.152: IC2.P$12 49.38,7.92 50.44,8.99 50.44,9.14 59.59,18.29 72.82,18.29 84.86,30.33 90.83,30.33 91.75,31.24 91.75,48.45 CN1.5 77.38,49.75 76.71,49.08 U1.24
SPI1_SCK
  Top 0.152: U1.23 77.4,48.68 77.59,48.87 87.13,48.87 87.14,48.87 88.82,48.87 CN1.4
  Bottom 0.152: IC2.P$10 44.2,7.77 45.26,6.71 45.26,6.55 46.18,5.64 85.65,5.64 92.05,12.04 92.05,45.72 90.53,47.24 CN1.4
USART_RX
  Bottom 0.152: IC2.P$8 39.01,7.92 38.56,7.92 36.88,9.6 36.12,9.6 35.05,8.53 35.05,6.55 34.44,5.94 33.53,5.94 32.46,7.01 32.46,9.6 13.72,28.35 13.72,29.87 8.84,34.75 8.08,34.75 7.16,35.66 6.4,35.66 5.64,36.42 5.64,42.37 9.3,46.02 9.6,46.02 J4.4
USART_TX
  Bottom 0.152: IC2.P$7 36.42,7.77 36.42,7.47 34.59,5.64 19.81,5.64 4.42,21.03 4.42,40.69 5.33,41.6 5.33,44.2 9.6,48.46 J4.3

### Text on the board
tPlace: USART | MPU9250 | MPU6050 | * | *
bPlace: ENC _D / ENC _C / 5V / GND | ENC _F / ENC _E / 5V / GND | DIN _B / DIN _A / 5V / GND | ENC _B / ENC _A / 5V / GND | DIN _D / DIN _C / 5V / GND | DIN _F / DIN _E / 5V / GND | GND / 5V | SPI1_MISO / SPI1_MOSI / SPI1_SCK | USART_TX / USART_RX | ー | CS / 3V3 / GND | I2C1_SDA / I2C1_SCL | 5V / GND | DIN _H / DIN _G / 5V / GND | Base_Board ver4.0 | tkd | 2022/10
tNames: ENC-AB | ENC-CD | ENC-EF | DIN-AB | DIN-CD | DIN-EF | SPI1 | * | I2C | * | DIN-GH | * | *
bNames: MPU-9250 | MPU-6050